# Altium schematic sheet externalConnectors.SchDoc: External Connectors
size A4; CheckedBy: None; DrawnBy: David, Andrea; Organization: ETSIT; DocumentNumber: 7; Revision: V1.0; SheetNumber: 7; SheetTotal: 7; Company: ETSIT; VersionRevision: v1.0; TotalSheet: 7; Project: Hefesto
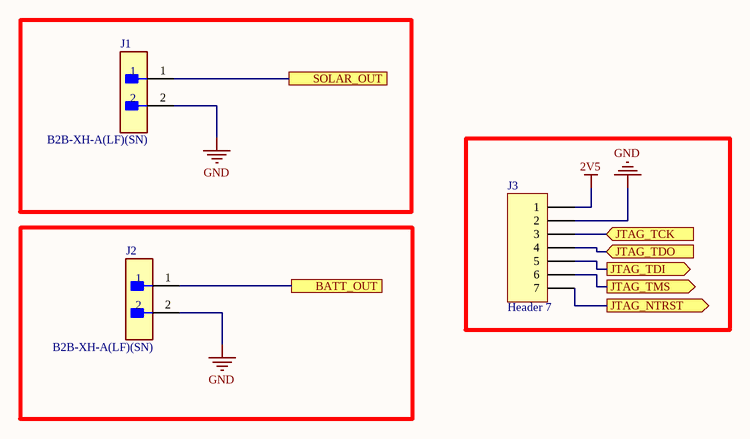
[diagram p0: externalConnectors.SchDoc]

## Parts
J1  B2B-XH-A(LF)(SN)  [FP-B2B-XH-A_LF_SN-MFG]
J2  B2B-XH-A(LF)(SN)  [FP-B2B-XH-A_LF_SN-MFG]
J3  Header 7  [HDR1X7]

## Ports
BATT_OUT (see main[3A]), JTAG_NTRST (out, see main[2B], soc[1B]), JTAG_TCK (in, see main[2B], soc[2A]), JTAG_TDI (out, see main[2B], soc[1A]), JTAG_TDO (in, see main[2B], soc[1B]), JTAG_TMS (out, see main[2B], soc[2B]), SOLAR_OUT (see main[3A])

## Nets
2V5: J3.1
GND: J1.2 J2.2 J3.2
BATT_OUT: J2.1 ; port BATT_OUT
JTAG_NTRST: J3.7 ; port JTAG_NTRST
JTAG_TCK: J3.3 ; port JTAG_TCK
JTAG_TDI: J3.5 ; port JTAG_TDI
JTAG_TDO: J3.4 ; port JTAG_TDO
JTAG_TMS: J3.6 ; port JTAG_TMS
SOLAR_OUT: J1.1 ; port SOLAR_OUT

## Notes on the sheet
- Title:
- Drawn By:
- Page Contents:
- Checked By:
- Size:
- Date:
- File:
- License:
- Email:
- A4
- Number:
- Time:
- Revision:
- Sheet
- Website:
- of

## Library data of the parts
J1 J2 = CMP-2000-05888-3: CONN HEADER VERT 2POS 2.5MM; Current Rating: 3A; Voltage Rating: 250V; Number of Contacts: 2; Contact Resistance: 20mR; Wire/Cable Gauge: 22AWG; Insulation Resistance: 1GR; Connector Type: Male Pin; Packaging: Bulk; Contact Material: Brass; Lead Free: Lead Free; Orientation: Straight; Contact Plating: Tin; Max Current Rating: 3A; Termination: Solder; Fastening Type: Detent; Depth: 5.75mm; Housing Material: Polyamide; REACH SVHC: No SVHC; Series: XH; Voltage Rating (AC): 250V; Number of Positions: 2; Color: Natural; Contact Type: Male Pin; Max Voltage Rating (DC): 250V; Pitch: 2.5mm; Lead Pitch: 2.5mm; Mount: Through Hole; Max Operating Temperature: 85°C; Length: 7.4mm; Max Voltage Rating (AC): 250V; Min Operating Temperature: -25°C; Number of Rows: 1; Housing Color: White
J3 = Header 7: Header, 7-Pin; LatestRevisionDate: 17-Jul-2002; LatestRevisionNote: Re-released for DXP Platform.; Publisher: Altium Limited